# EAGLE design Cansat2019_3279_Container_v04 (EAGLE 7.3.0)
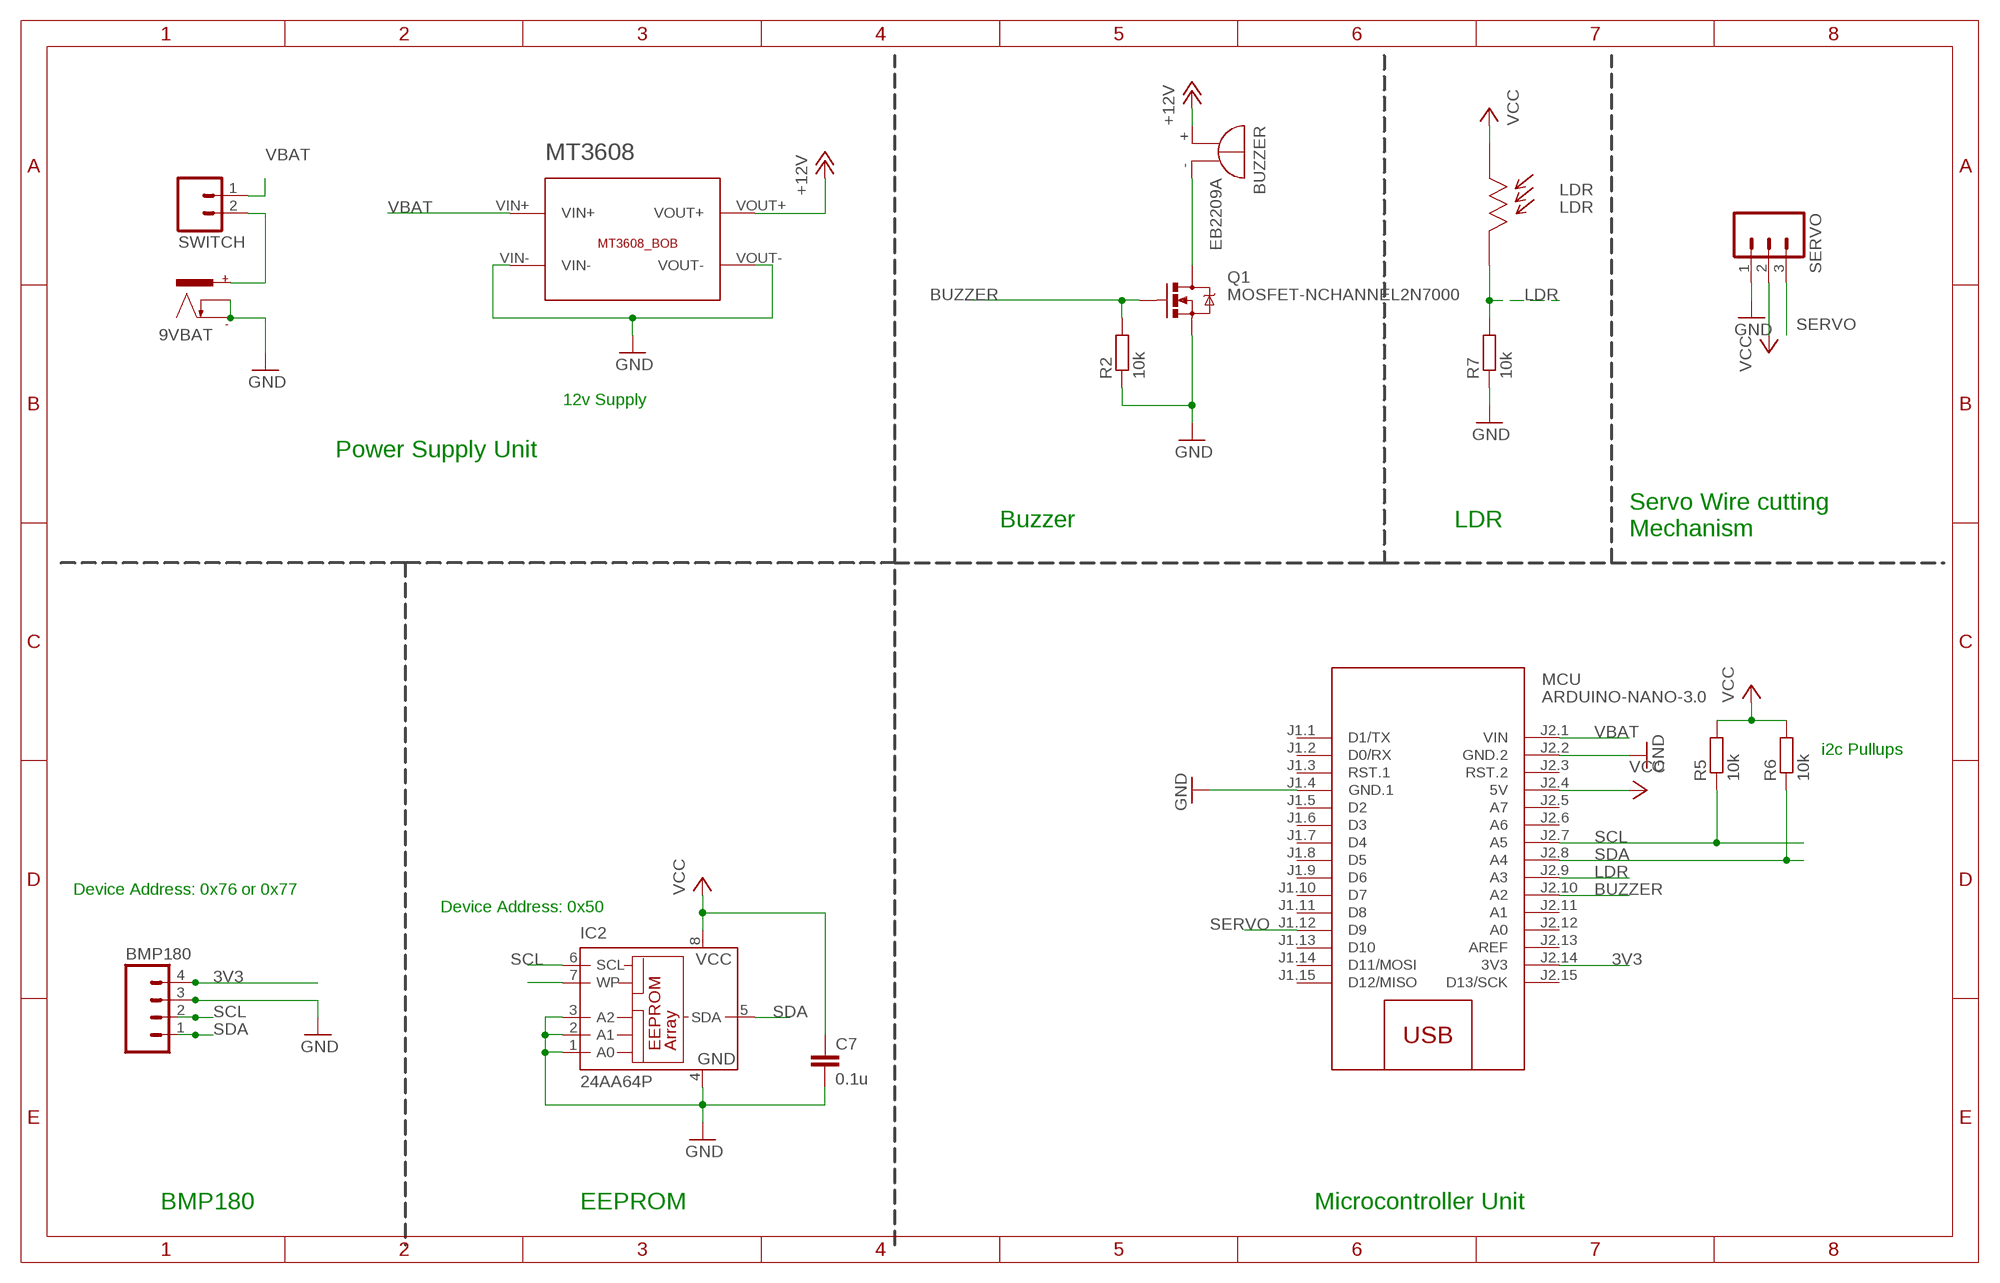
[diagram p0: schematic, sheet 1]

## Parts
9VBAT  POWER_CON  [NEB21R]
BMP180  M04  [04P]
BUZZER  EB2209A  [EB2209A]
C7  0.1u  C-EU025-025X050  [C025-025X050]
IC2  24AA64P  [DIL8]
LDR  LDR  [LDR-5MM]
MCU  ARDUINO-NANO-3.0  [ARDUINO-NANO-3.0]
MT3608  MT3608_BOB  [MT3608_BOB]
Q1  MOSFET-NCHANNEL2N7000  [TO-92]
R2  10k  R-EU_0204/7  [0204/7]
R5  10k  R-EU_0204/7  [0204/7]
R6  10k  R-EU_0204/7  [0204/7]
R7  10k  R-EU_0204/7  [0204/7]
SERVO  M03  [03P]
SWITCH  M02  [02P]

## Nets
3V3 [power]: BMP180.4 MCU.J2.14(3V3)
+12V [power]: BUZZER.+ MT3608.VOUT+
BUZZER: MCU.J2.10(A2) Q1.2(G) R2.2
GND [power]: 9VBAT.- 9VBAT.C BMP180.3 C7.2 IC2.1(A0) IC2.2(A1) IC2.3(A2) IC2.4(GND) MCU.J1.4(GND.1) MCU.J2.2(GND.2) MT3608.VIN- MT3608.VOUT- Q1.1(S) R2.1 R7.1 SERVO.1
LDR: LDR.P$2 MCU.J2.9(A3) R7.2
N$1 [power]: BUZZER.- Q1.3(D)
N$6 [burner]: 9VBAT.+ SWITCH.2
N$8: IC2.7(WP)
SCL: BMP180.2 IC2.6(SCL) MCU.J2.7(A5) R5.1
SDA: BMP180.1 IC2.5(SDA) MCU.J2.8(A4) R6.1
SERVO: MCU.J1.12(D9) SERVO.3
VBAT [power]: MCU.J2.1(VIN) MT3608.VIN+ SWITCH.1
VCC [power]: C7.1 IC2.8(VCC) LDR.P$1 MCU.J2.4(5V) R5.2 R6.2 SERVO.2
Unconnected: MCU.J1.1(D1/TX) MCU.J1.2(D0/RX) MCU.J1.3(RST.1) MCU.J1.5(D2) MCU.J1.6(D3) MCU.J1.7(D4) MCU.J1.8(D5) MCU.J1.9(D6) MCU.J1.10(D7) MCU.J1.11(D8) MCU.J1.13(D10) MCU.J1.14(D11/MOSI) MCU.J1.15(D12/MISO) MCU.J2.3(RST.2) MCU.J2.5(A7) MCU.J2.6(A6) MCU.J2.11(A1) MCU.J2.12(A0) MCU.J2.13(AREF) MCU.J2.15(D13/SCK)

## Notes on the sheet
- 12v Supply
- Power Supply Unit
- Buzzer | LDR
- Servo Wire cutting
  Mechanism
- i2c Pullups
- Device Address: 0x76 or 0x77
- Device Address: 0x50
- BMP180 | EEPROM | Microcontroller Unit

## Library data of the parts
9VBAT = CEDT_JANUARY_2015_v5:POWER_CON: DC Power Connector
BMP180 = con-amp-quick:M04: AMP QUICK CONNECTOR; OC_FARNELL: unknown; OC_NEWARK: unknown
BUZZER = buzzer:EB2209A: BUZZER Source: Buerklin; OC_FARNELL: unknown; OC_NEWARK: unknown
C7 = rcl:C-EU: CAPACITOR, European symbol
IC2 = microchip:24*: Serial EEPROM I2C; MF: MICROCHIP; MPN: 24AA64-I/P; OC_FARNELL: 1331303; OC_NEWARK: 92C6909
LDR = msp framework:LDR: Light Dependent Resistor Sunrom Product Page <http://www.sunrom.com/p/ldr-5mm-light-dependent-resistor>; SUNROM: 3190
MCU = diy-modules:ARDUINO-NANO-3.0: Arduino Nano 3.0 and compatible devices More details available here: https://www.arduino.cc/en/Main/ArduinoBoardNano Click here to find device on ebay.com <http://www.ebay.com/sch/arduino+nano>
MT3608 = Breakouts:MT3608_BOB
Q1 = SparkFun-DiscreteSemi:MOSFET-NCHANNEL: Common NMOSFET Parts MFG P/N Store ID Prod ID FDD8780 TRANS-09984 SI7820DN TRANS-11055 FDS6630A IC-08089 2N7002PW TRANS-11151 FQP30N06L COM-10213 TRANS-10060 BSS123LT1G TRANS-08345 BSS138 TRANS-00830 BS170 2N7000
R2 R5-R7 = rcl:R-EU_: RESISTOR, European symbol
SERVO = msp framework:M03: AMP QUICK CONNECTOR
SWITCH = CEDT_JANUARY_2015_v5:M02: AMP QUICK CONNECTOR

## Net classes
0 default: width 0.305 mm, clearance 0.305 mm
1 power: width 0.61 mm, clearance 0.305 mm
2 burner: width 0.813 mm, clearance 0.305 mm

## Board
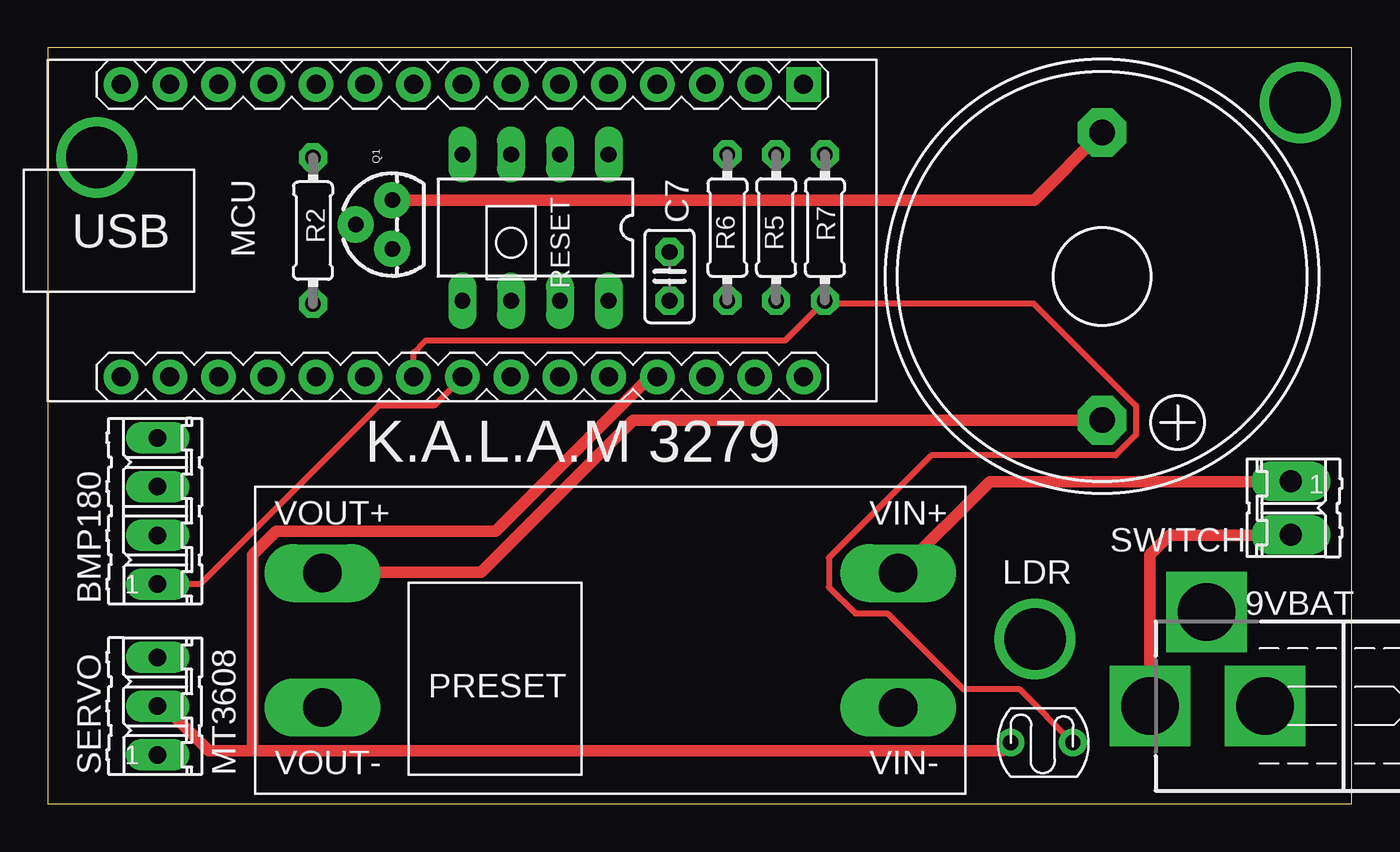
[diagram p1: board, top side]
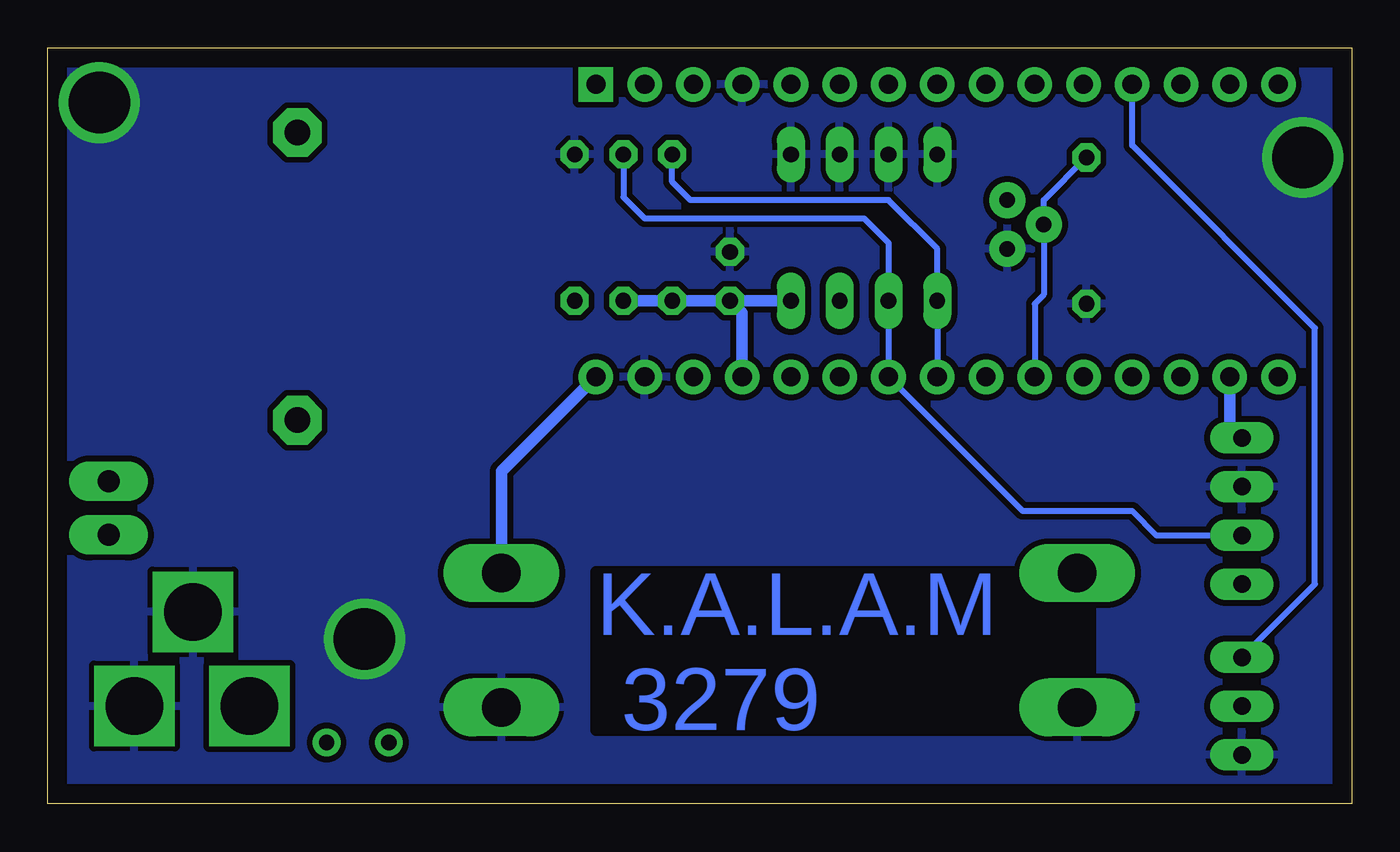
[diagram p2: board, bottom side, seen from below]

Size 67.92 x 39.36 mm. Coordinates in mm from the lower left corner, seen from the top.
Outline: 0,0 67.92,0 67.92,39.36 0,39.36 0,0
Copper layers (1*16): Top 0.035mm / dielectric 1.5mm / Bottom 0.035mm
Design rules "8085_board": minimum track width 10mil, minimum drill 24mil, track to track 8mil, track to pad 8mil, pad to pad 8mil, via to via 8mil, smd to smd 8mil, copper to edge 40mil, drill to drill 8mil, minimum pad ring 12mil, minimum via ring 12mil, stop-mask expansion 4mil, vias tented up to drill 0mil, thermal gap 10mil

### Footprints (pad centres in the part's own frame; a part is rotated, then mirrored left to right if it is on the bottom)
NEB21R = drill 3 pad 4.2 square: + 0,3.54; - 0,-2.46; C 4.9,0.59
04P = drill 0.914 long: 1 -3.81,0; 2 -1.27,0; 3 1.27,0; 4 3.81,0
EB2209A = drill 1.321 pad 2.54 octagon: + 7.493,0; - -7.493,0
C025-025X050 = drill 0.813 octagon: 1 -1.27,0; 2 1.27,0
DIL8 = drill 0.813 long: 1 -3.81,-3.81; 2 -1.27,-3.81; 3 1.27,-3.81; 4 3.81,-3.81; 5 3.81,3.81; 6 1.27,3.81; 7 -1.27,3.81; 8 -3.81,3.81
LDR-5MM = drill 0.8: P$1 0,0; P$2 3.24,0
ARDUINO-NANO-3.0 = drill 1 square: J1.1 17.78,7.62 | drill 1: J1.2 15.24,7.62; J1.3 12.7,7.62; J1.4 10.16,7.62; J1.5 7.62,7.62; J1.6 5.08,7.62; J1.7 2.54,7.62; J1.8 0,7.62; J1.9 -2.54,7.62; J1.10 -5.08,7.62; J1.11 -7.62,7.62; J1.12 -10.16,7.62; J1.13 -12.7,7.62; J1.14 -15.24,7.62; J1.15 -17.78,7.62; J2.1 17.78,-7.62; J2.2 15.24,-7.62; J2.3 12.7,-7.62; J2.4 10.16,-7.62; J2.5 7.62,-7.62; J2.6 5.08,-7.62; J2.7 2.54,-7.62; J2.8 0,-7.62; J2.9 -2.54,-7.62; J2.10 -5.08,-7.62; J2.11 -7.62,-7.62; J2.12 -10.16,-7.62; J2.13 -12.7,-7.62; J2.14 -15.24,-7.62; J2.15 -17.78,-7.62
MT3608_BOB = drill 2 pad 3 long: VIN+ 33.5,-4.5; VIN- 33.5,-11.5; VOUT+ 3.5,-4.5; VOUT- 3.5,-11.5
TO-92 = drill 0.813 pad 1.88: 1 -1.27,0; 2 0,1.905; 3 1.27,0
0204/7 = drill 0.813 octagon: 1 -3.81,0; 2 3.81,0
03P = drill 0.914 long: 1 -2.54,0; 2 0,0; 3 2.54,0
02P = drill 1.143 long: 1 -1.397,0; 2 1.397,0

### Placement (x,y rotation side)
9VBAT  60.96,5.08 90 top
BMP180  5.71,15.24 90 top
BUZZER  54.93,27.46 270 top
C7  32.38,27.46 90 top
IC2  25.4,30 180 top
LDR  50.16,3.17 0 top
MCU  21.59,29.84 0 top
MT3608  10.79,16.51 0 top
Q1  17.94,30.16 90 top
R2  13.81,29.84 90 top
R5  37.94,30 270 top
R6  35.4,30 270 top
R7  40.48,30 270 top
SERVO  5.71,5.08 90 top
SWITCH  64.77,15.4 270 top

### Tracks (layer width: path | path; a pad name or v marks a point on that pad's centre or on a via)
3V3
  Bottom 0.61: MCU.J2.14 6.35,19.68 BMP180.4
+12V
  Top 0.61: BUZZER.+ 54.86,19.96 30.48,19.96 22.55,12.04 14.33,12.04 MT3608.VOUT+
BUZZER
  Bottom 0.305: R2.2 16.03,31.43 Q1.2 16.03,26.51 16.51,26.04 MCU.J2.10
GND  (via drill 3.2)
  other vias: 2.54,33.66 65.25,36.51 51.44,8.57
  pour Bottom: -0.64,40.01 68.58,40.01 68.58,-0.64 -0.64,-0.64
LDR
  Top 0.305: MCU.J2.9 19.05,23.5 19.68,24.13 38.42,24.13 R7.2 40.54,26.06 51.36,26.06 56.69,20.73 56.69,19.2 55.63,18.14 46.02,18.14 40.69,12.8 40.69,11.28 42.06,9.91 43.74,9.91 47.7,5.94 50.64,5.94 LDR.P$2
N$1
  Top 0.61: Q1.3 51.4,31.43 BUZZER.-
N$6
  Top 0.61: 9VBAT.+ 57.42,12.97 58.42,13.97 64.74,13.97 SWITCH.2
SCL
  Bottom 0.305: R5.1 37.94,31.59 36.83,30.48 25.4,30.48 24.13,29.21 IC2.6 MCU.J2.7 17.14,15.24 11.43,15.24 10.16,13.97 BMP180.2
SDA
  Top 0.305: BMP180.1 7.92,11.43 17.22,20.73 20.12,20.73 21.49,22.1 MCU.J2.8
  Bottom 0.305: MCU.J2.8 IC2.5 21.59,28.89 24.13,31.43 34.45,31.43 35.4,32.38 R6.1
SERVO
  Bottom 0.305: SERVO.3 1.91,11.43 1.91,24.77 11.43,34.29 MCU.J1.12
VBAT
  Top 0.61: SWITCH.1 64.77,16.76 49.07,16.76 44.35,12.04 MT3608.VIN+
  Bottom 0.61: MT3608.VIN+ 44.3,17.3 MCU.J2.1
VCC
  Top 0.61: 10.67,2.74 8.38,2.74 6.1,5.03 5.79,5.03 SERVO.2 | 10.67,2.74 49.73,2.74 LDR.P$1 | 10.67,2.74 10.67,12.95 11.89,14.17 23.32,14.17 31.24,22.1 31.7,22.1 MCU.J2.4
  Bottom 0.61: C7.1 IC2.8 | MCU.J2.4 31.75,25.56 C7.1 | C7.1 R6.2 R5.2

### Text on the board
Bottom: K.A.L.A.M / 3279
tPlace: K.A.L.A.M 3279